# Altium schematic sheet SpeakEasy_Power.SchDoc
size A
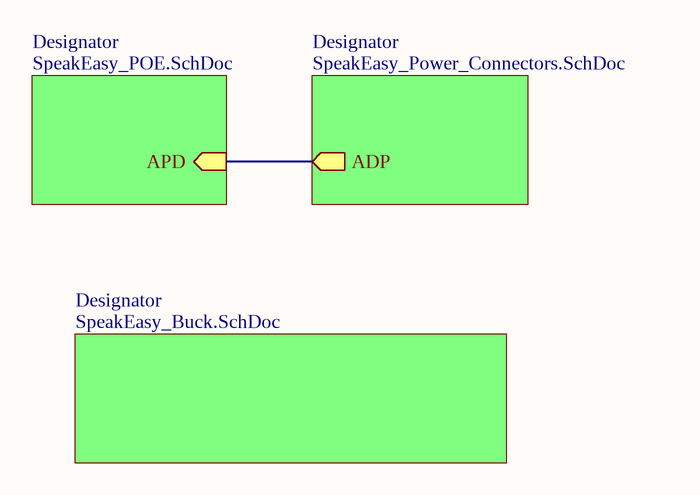
[diagram p0: SpeakEasy_Power.SchDoc]

## Sub-sheets
Designator = SpeakEasy_POE.SchDoc: APD (in)
Designator = SpeakEasy_Power_Connectors.SchDoc: ADP (out)
Designator = SpeakEasy_Buck.SchDoc: no entries

## Nets
(unnamed): sheet Designator/APD, sheet Designator/ADP